# EAGLE schematic SoftDrink-SchematicFile (EAGLE 7.4.0)
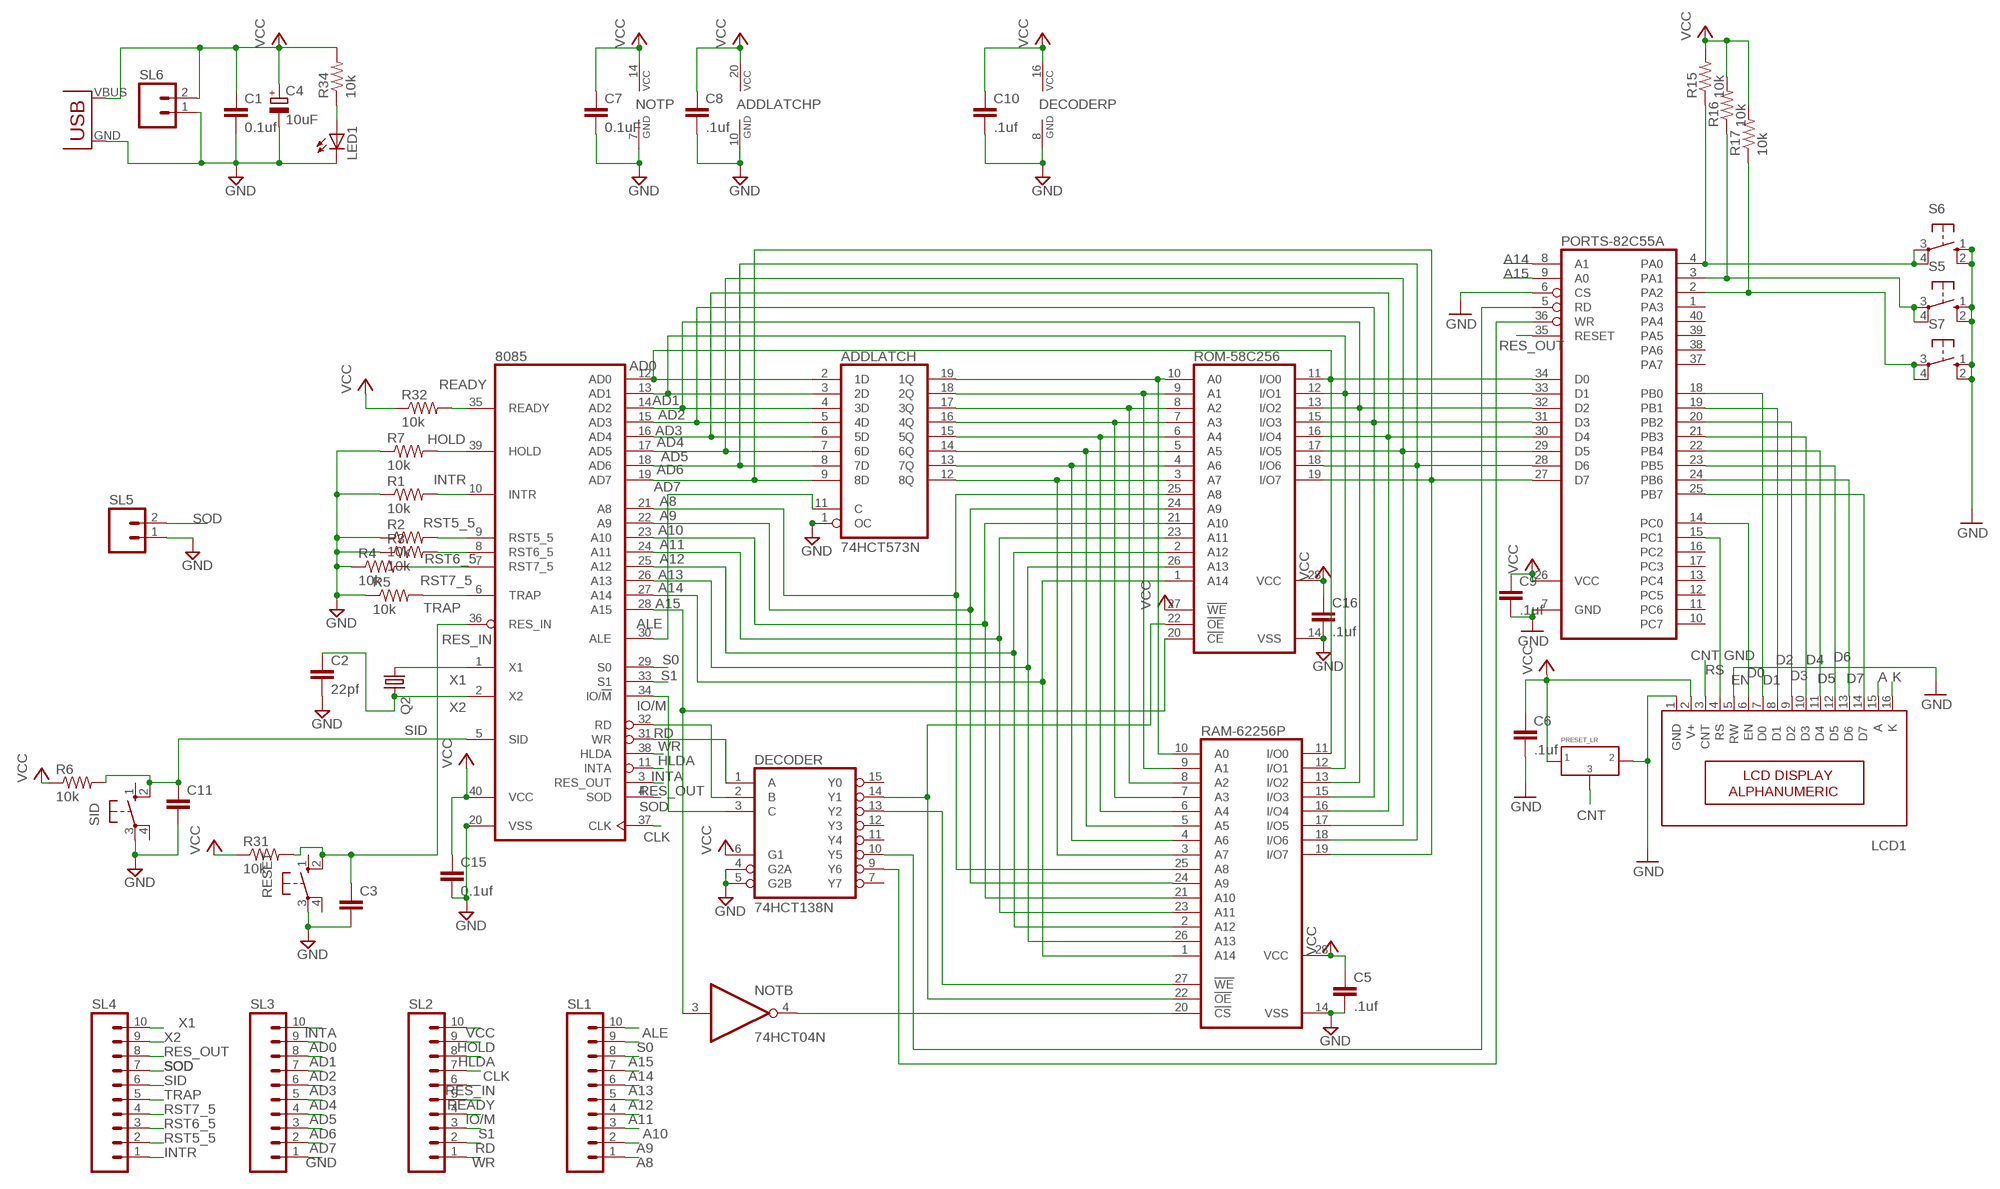
[diagram p0: schematic, sheet 1]

## Parts
8085  8085  [DIL40]
ADDLATCH  74HCT573N  [DIL20]
C1  0.1uf  C-EU025-024X044  [C025-024X044]
C2  22pf  C-EU025-024X044  [C025-024X044]
C3  C-EU025-025X050  [C025-025X050]
C4  10uF  CPOL-EUE5-8.5  [E5-8,5]
C5  .1uf  C-EU025-024X044  [C025-024X044]
C6  .1uf  C-EU025-024X044  [C025-024X044]
C7  0.1uF  C-EU025-024X044  [C025-024X044]
C8  .1uf  C-EU025-024X044  [C025-024X044]
C9  .1uf  C-EU025-024X044  [C025-024X044]
C10  .1uf  C-EU025-024X044  [C025-024X044]
C11  C-EU025-025X050  [C025-025X050]
C15  0.1uf  C-EU025-024X044  [C025-024X044]
C16  .1uf  C-EU025-024X044  [C025-024X044]
DECODER  74HCT138N  [DIL16]
LCD1  16X2LCD  [16X2_LCD]
LED1  LED5MM  [LED5MM]
NOT  74HCT04N  [DIL14]
PORTS-82C55A  82C55A  [DIL40]
Q2  CRYSTALHC49US  [HC49US]
R1  10k  R-US_0207/7  [0207/7]
R2  10k  R-US_0207/7  [0207/7]
R3  10k  R-US_0207/7  [0207/7]
R4  10k  R-US_0207/7  [0207/7]
R5  10k  R-US_0207/7  [0207/7]
R6  10k  R-US_0207/7  [0207/7]
R7  10k  R-US_0207/7  [0207/7]
R15  10k  R-US_0207/7  [0207/7]
R16  10k  R-US_0207/7  [0207/7]
R17  10k  R-US_0207/7  [0207/7]
R31  10k  R-US_0207/7  [0207/7]
R32  10k  R-US_0207/7  [0207/7]
R34  10k  R-US_0207/7  [0207/7]
RAM-62256P  62256P  [DIL28-6]
RESET  10-XX  [B3F-10XX]
ROM-58C256  58C256P  [DIL28-6]
S5  10-XX  [B3F-10XX]
S6  10-XX  [B3F-10XX]
S7  10-XX  [B3F-10XX]
SID  10-XX  [B3F-10XX]
SL1  M10  [10P]
SL2  M10  [10P]
SL3  M10  [10P]
SL4  M10  [10P]
SL5  M02  [02P]
SL6  M02  [02P]
U$2  USB(POWER)  [USB(POWER)]
U$3  PRESET_LR  [PRESET_LR]

## Nets
A: LCD1.15(A)
A8: 8085.21(A8) RAM-62256P.25(A8) ROM-58C256.25(A8) SL1.1
A9: 8085.22(A9) RAM-62256P.24(A9) ROM-58C256.24(A9) SL1.2
A10: 8085.23(A10) RAM-62256P.21(A10) ROM-58C256.21(A10) SL1.3
A11: 8085.24(A11) RAM-62256P.23(A11) ROM-58C256.23(A11) SL1.4
A12: 8085.25(A12) RAM-62256P.2(A12) ROM-58C256.2(A12) SL1.5
A13: 8085.26(A13) RAM-62256P.26(A13) ROM-58C256.26(A13) SL1.6
A14: 8085.27(A14) PORTS-82C55A.8(A1) RAM-62256P.1(A14) ROM-58C256.1(A14) SL1.7
A15: 8085.28(A15) NOT.3(B:I) PORTS-82C55A.9(A0) ROM-58C256.20(!CE) SL1.8
AD0: 8085.12(AD0) ADDLATCH.2(1D) PORTS-82C55A.34(D0) RAM-62256P.11(I/O0) ROM-58C256.11(I/O0) SL3.9
AD1: 8085.13(AD1) ADDLATCH.3(2D) PORTS-82C55A.33(D1) RAM-62256P.12(I/O1) ROM-58C256.12(I/O1) SL3.8
AD2: 8085.14(AD2) ADDLATCH.4(3D) PORTS-82C55A.32(D2) RAM-62256P.13(I/O2) ROM-58C256.13(I/O2) SL3.7
AD3: 8085.15(AD3) ADDLATCH.5(4D) PORTS-82C55A.31(D3) RAM-62256P.15(I/O3) ROM-58C256.15(I/O3) SL3.6
AD4: 8085.16(AD4) ADDLATCH.6(5D) PORTS-82C55A.30(D4) RAM-62256P.16(I/O4) ROM-58C256.16(I/O4) SL3.5
AD5: 8085.17(AD5) ADDLATCH.7(6D) PORTS-82C55A.29(D5) RAM-62256P.17(I/O5) ROM-58C256.17(I/O5) SL3.4
AD6: 8085.18(AD6) ADDLATCH.8(7D) PORTS-82C55A.28(D6) RAM-62256P.18(I/O6) ROM-58C256.18(I/O6) SL3.3
AD7: 8085.19(AD7) ADDLATCH.9(8D) PORTS-82C55A.27(D7) RAM-62256P.19(I/O7) ROM-58C256.19(I/O7) SL3.2
ALE: 8085.30(ALE) ADDLATCH.11(C) SL1.10
CLK: 8085.37(CLK) SL2.7
CNT: LCD1.3(CNT) U$3.P$3
D0: LCD1.7(D0) PORTS-82C55A.18(PB0)
D1: LCD1.8(D1) PORTS-82C55A.19(PB1)
D2: LCD1.9(D2) PORTS-82C55A.20(PB2)
D3: LCD1.10(D3) PORTS-82C55A.21(PB3)
D4: LCD1.11(D4) PORTS-82C55A.22(PB4)
D5: LCD1.12(D5) PORTS-82C55A.23(PB5)
D6: LCD1.13(D6) PORTS-82C55A.24(PB6)
D7: LCD1.14(D7) PORTS-82C55A.25(PB7)
EN: LCD1.6(EN) PORTS-82C55A.14(PC0)
GND [GND]: 8085.20(VSS) ADDLATCH.1(OC) ADDLATCH.10(GND) C1.2 C2.2 C3.2 C4.- C5.2 C6.2 C7.2 C8.2 C9.2 C10.2 C11.2 C15.2 C16.2 DECODER.4(G2A) DECODER.5(G2B) DECODER.8(GND) LCD1.1(GND) LCD1.5(RW) LED1.K(C) NOT.7(P:GND) PORTS-82C55A.6(CS) PORTS-82C55A.7(GND) R1.1 R2.1 R3.1 R4.1 R5.1 R7.1 RAM-62256P.14(VSS) RESET.3(P) ROM-58C256.14(VSS) S5.1(S) S5.2(S1) S6.1(S) S6.2(S1) S7.1(S) S7.2(S1) SID.3(P) SL3.1 SL5.1 SL6.1 U$2.GND U$3.P$2
HLDA: 8085.38(HLDA) SL2.8
HOLD: 8085.39(HOLD) R7.2 SL2.9
INTA: 8085.11(INTA) SL3.10
INTR: 8085.10(INTR) R1.2 SL4.1
IO/M: 8085.34(IO/!M) DECODER.3(C) SL2.4
K: LCD1.16(K)
N$10: ADDLATCH.19(1Q) RAM-62256P.10(A0) ROM-58C256.10(A0)
N$11: ADDLATCH.18(2Q) RAM-62256P.9(A1) ROM-58C256.9(A1)
N$12: ADDLATCH.17(3Q) RAM-62256P.8(A2) ROM-58C256.8(A2)
N$13: ADDLATCH.16(4Q) RAM-62256P.7(A3) ROM-58C256.7(A3)
N$14: ADDLATCH.15(5Q) RAM-62256P.6(A4) ROM-58C256.6(A4)
N$15: ADDLATCH.14(6Q) RAM-62256P.5(A5) ROM-58C256.5(A5)
N$16: ADDLATCH.13(7Q) RAM-62256P.4(A6) ROM-58C256.4(A6)
N$17: ADDLATCH.12(8Q) RAM-62256P.3(A7) ROM-58C256.3(A7)
N$28: DECODER.9(Y6) PORTS-82C55A.36(WR)
N$44: LED1.A R34.1
N$47: PORTS-82C55A.4(PA0) R15.1 S6.3(P) S6.4(P1)
N$49: PORTS-82C55A.2(PA2) R17.1 S7.3(P) S7.4(P1)
N$50: PORTS-82C55A.3(PA1) R16.1 S5.3(P) S5.4(P1)
N$57: DECODER.14(Y1) RAM-62256P.22(!OE) ROM-58C256.22(!OE)
N$58: DECODER.13(Y2) RAM-62256P.27(!WE)
N$60: NOT.4(B:O) RAM-62256P.20(!CS)
N$80: DECODER.10(Y5) PORTS-82C55A.5(RD)
RD: 8085.32(RD) DECODER.2(B) SL2.2
READY: 8085.35(READY) R32.2 SL2.5
RES_IN: 8085.36(RES_IN) C3.1 R31.2 RESET.2(S1) SL2.6
RES_OUT: 8085.3(RES_OUT) PORTS-82C55A.35(RESET) SL4.8
RS: LCD1.4(RS) PORTS-82C55A.15(PC1)
RST5_5: 8085.9(RST5_5) R2.2 SL4.2
RST6_5: 8085.8(RST6_5) R3.2 SL4.3
RST7_5: 8085.7(RST7_5) R4.2 SL4.4
S0: 8085.29(S0) SL1.9
S1: 8085.33(S1) SL2.3
SID: 8085.5(SID) C11.1 R6.2 SID.2(S1) SL4.6
SOD: 8085.4(SOD) SL4.7 SL5.2
TRAP: 8085.6(TRAP) R5.2 SL4.5
VCC [VCC]: 8085.40(VCC) ADDLATCH.20(VCC) C1.1 C4.+ C5.1 C6.1 C7.1 C8.1 C9.1 C10.1 C15.1 C16.1 DECODER.6(G1) DECODER.16(VCC) LCD1.2(V+) NOT.14(P:VCC) PORTS-82C55A.26(VCC) R6.1 R15.2 R16.2 R17.2 R31.1 R32.1 R34.2 RAM-62256P.28(VCC) ROM-58C256.27(!WE) ROM-58C256.28(VCC) SL2.10 SL6.2 U$2.VBUS(VCC) U$3.P$1
WR: 8085.31(WR) DECODER.1(A) SL2.1
X1: 8085.1(X1) Q2.1 SL4.10
X2: 8085.2(X2) C2.1 Q2.2 SL4.9
Unconnected: DECODER.7(Y7) DECODER.11(Y4) DECODER.12(Y3) DECODER.15(Y0) NOT.1(A:I) NOT.2(A:O) NOT.5(C:I) NOT.6(C:O) NOT.8(D:O) NOT.9(D:I) NOT.10(E:O) NOT.11(E:I) NOT.12(F:O) NOT.13(F:I) PORTS-82C55A.1(PA3) PORTS-82C55A.10(PC7) PORTS-82C55A.11(PC6) PORTS-82C55A.12(PC5) PORTS-82C55A.13(PC4) PORTS-82C55A.16(PC2) PORTS-82C55A.17(PC3) PORTS-82C55A.37(PA7) PORTS-82C55A.38(PA6) PORTS-82C55A.39(PA5) PORTS-82C55A.40(PA4) RESET.1(S) RESET.4(P1) SID.1(S) SID.4(P1)

## Library data of the parts
8085 = micro-intel:8085: MICROCOMPUTER/PERIPHERAL DEVICE; OC_FARNELL: unknown; OC_NEWARK: unknown
ADDLATCH = 74xx-eu:74*573: 8-bit D latch BUS DRIVER
C1-C3 C5-C11 C15 C16 = rcl:C-EU: CAPACITOR, European symbol
C4 = rcl:CPOL-EU: POLARIZED CAPACITOR, European symbol
DECODER = 74xx-eu:74*138: 3-line to 8-line DECODER/DEMULTIPLEXER
LCD1 = CEDTv79:16X2LCD: ALPHANUMERIC-LCD
LED1 = CEDTv79:LED
NOT = 74xx-eu:74*04: Hex INVERTER
PORTS-82C55A = micro-intel:82C55A: MICROCOMPUTER/PERIPHERAL DEVICE; MF: INTERSIL; MPN: IP82C55AZ; OC_FARNELL: 1562050; OC_NEWARK: 79K6939
Q2 = CEDT:CRYSTAL: Crystals Various standard crystals. Proven footprints. Spark Fun Electronics SKU : COM-00534
R1-R7 R15-R17 R31 R32 R34 = rcl:R-US_: RESISTOR, American symbol
RAM-62256P = memory-hitachi:62256P: MEMORY; OC_FARNELL: unknown; OC_NEWARK: unknown
RESET SID = CEDT:10-XX: OMRON SWITCH
ROM-58C256 = memory-hitachi:58C256P: MEMORY; MPN: HN58C256AP85E; OC_FARNELL: 1496447; OC_NEWARK: 61M6616
S5-S7 = CEDTv79:10-XX: OMRON SWITCH
SL1-SL4 = con-amp-quick:M10: AMP QUICK CONNECTOR; OC_FARNELL: unknown; OC_NEWARK: unknown
SL5 SL6 = CEDT_JANUARY_2015_v5:M02: AMP QUICK CONNECTOR
U$2 = CEDT_JANUARY_2015_v5:USB(POWER)
U$3 = CEDT_JANUARY_2015_v5:PRESET_LR

## Net classes
0 default: width 0.305 mm
1 VCC: width 0.508 mm
2 GND: width 0.508 mm